# Altium schematic sheet [04] - Connectors.SchDoc
size A3; DocumentNumber: 2; SheetNumber: 2; SheetTotal: 4
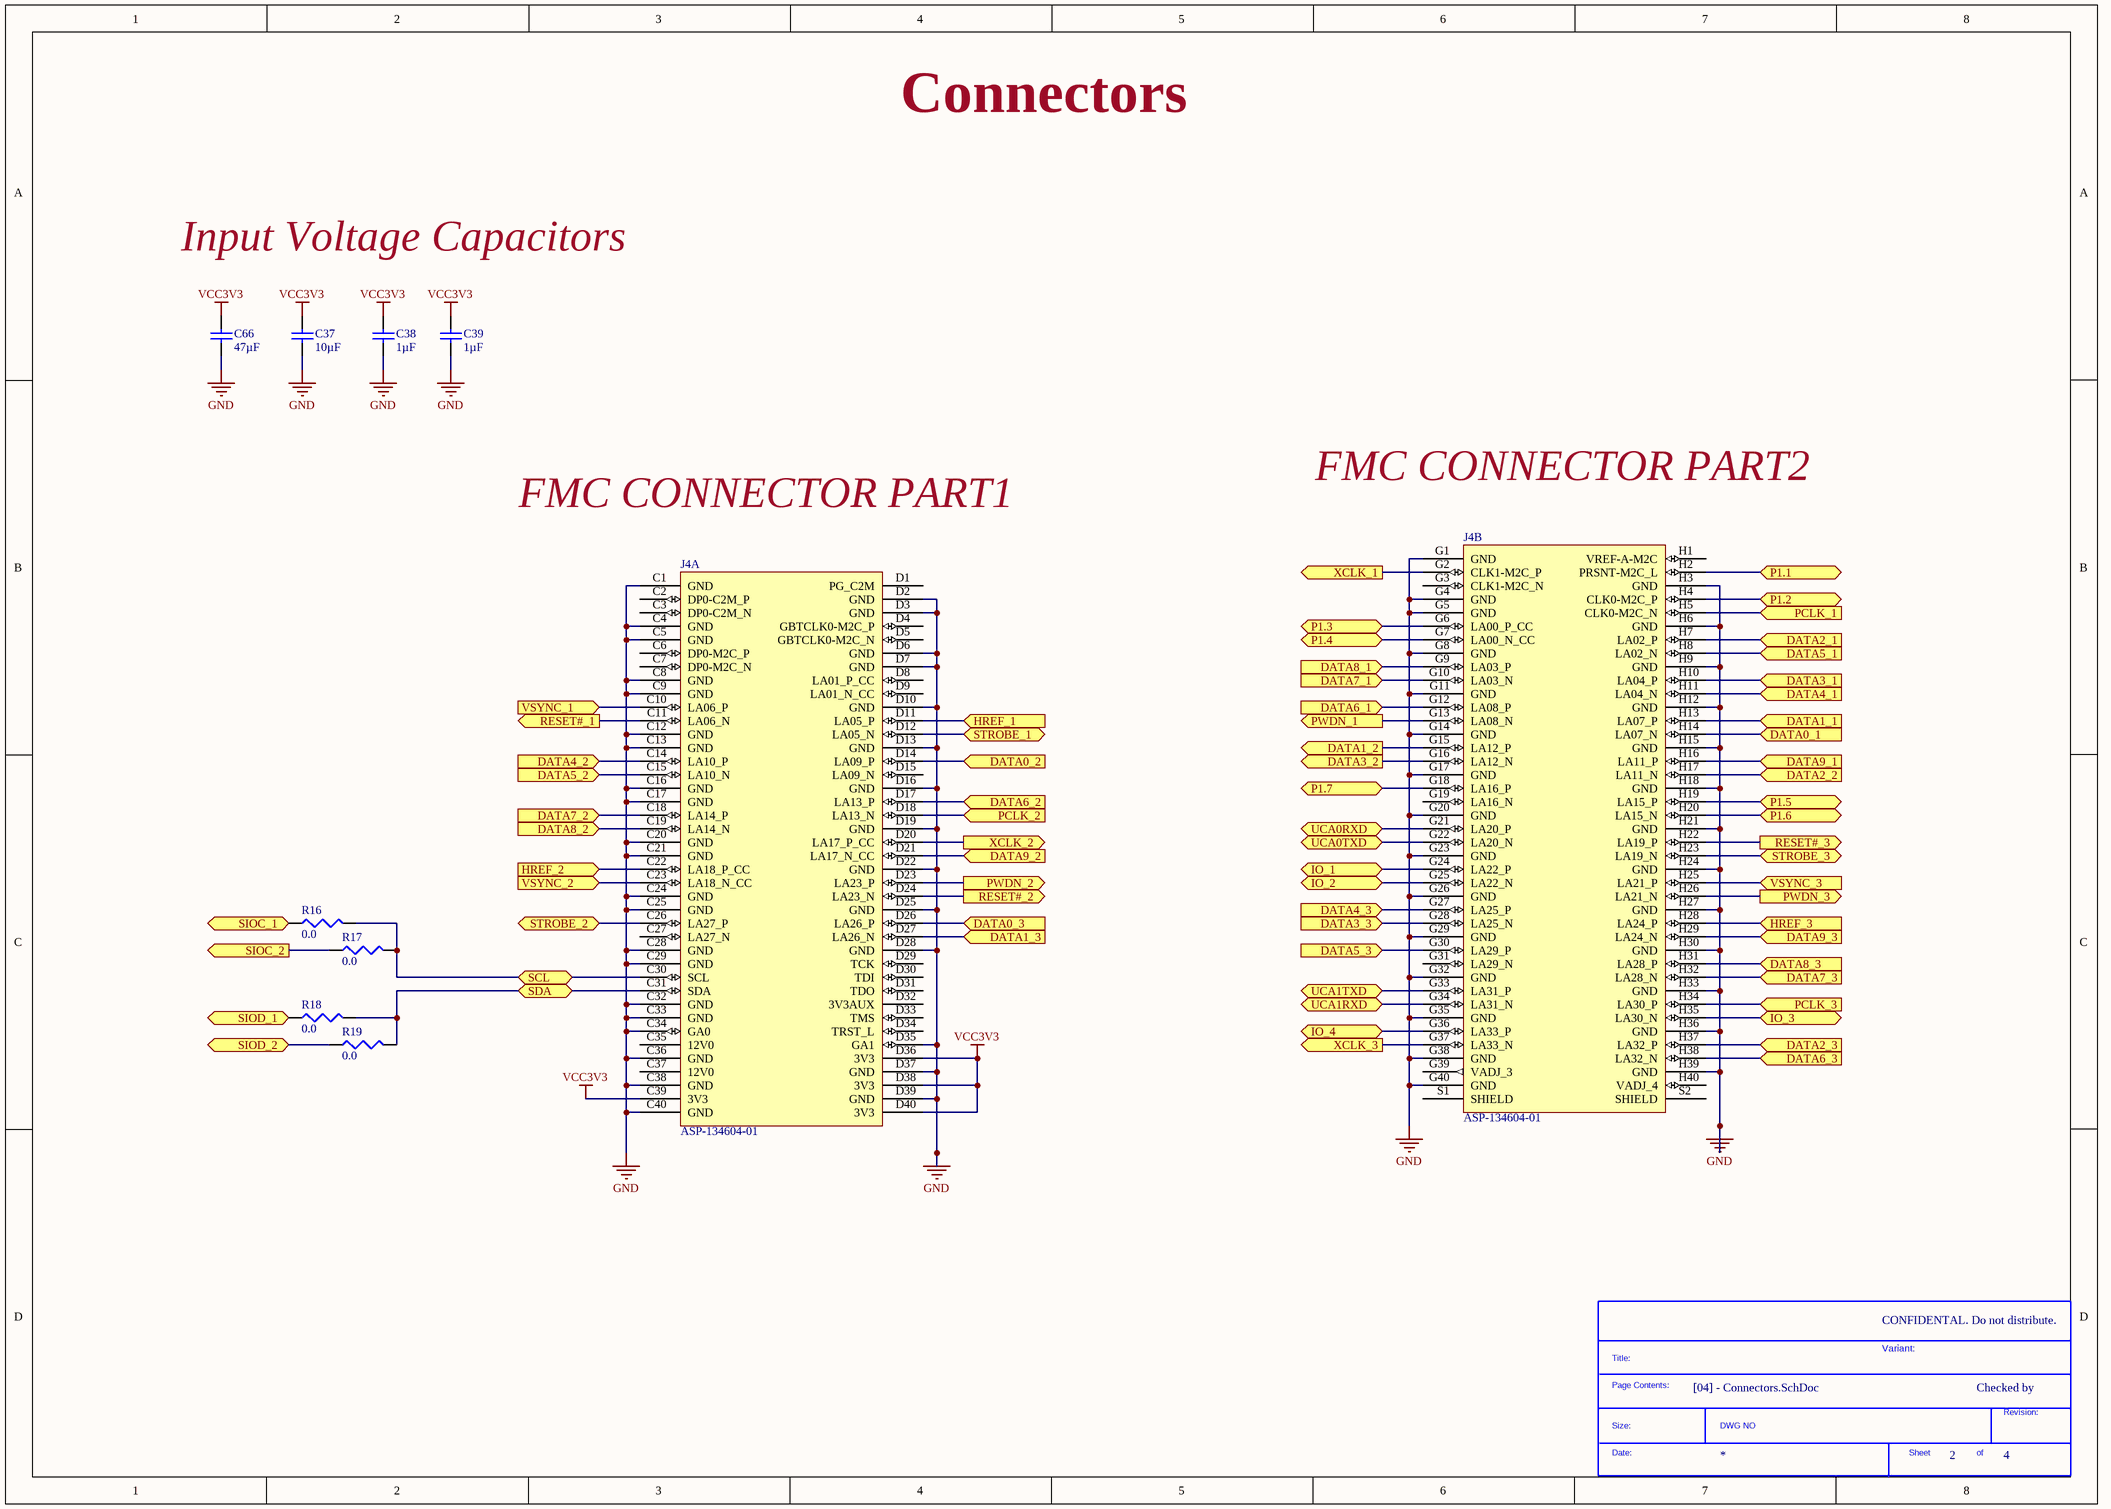
[diagram p0: [04] - Connectors.SchDoc]

## Parts
*  SDTitleBlock  (value not drawn)  (graphical)
C37  Capacitance: 10µF  [CAP-0805]  (hidden comment: GRM21BR61E106KA73L)
C38  Capacitance: 1µF  [CAP-0603]  (hidden comment: GRM188R71C105KA12D)
C39  Capacitance: 1µF  [CAP-0603]  (hidden comment: GRM188R71C105KA12D)
C66  Capacitance: 47µF  [CAP-0805]  (hidden comment: GRM21BR60J476ME15L)
J4  ASP-134604-01  [ASP-134604-01]  (parts A,B of 2)
R16  Resistance (Ohms): 0.0  [R0603]  (hidden comment: ERJ-3GEY0R00V)
R17  Resistance (Ohms): 0.0  [R0603]  (hidden comment: ERJ-3GEY0R00V)
R18  Resistance (Ohms): 0.0  [R0603]  (hidden comment: ERJ-3GEY0R00V)
R19  Resistance (Ohms): 0.0  [R0603]  (hidden comment: ERJ-3GEY0R00V)

## Ports
DATA0_1 (in), DATA0_2 (in), DATA0_3 (in), DATA1_1 (in), DATA1_2 (out), DATA1_3 (in), DATA2_1 (in), DATA2_2 (in), DATA2_3 (in), DATA3_1 (in), DATA3_2 (out), DATA3_3 (in), DATA4_1 (in), DATA4_2 (in), DATA4_3 (in), DATA5_1 (in), DATA5_2 (in), DATA5_3 (in), DATA6_1 (in), DATA6_2 (in), DATA6_3 (in), DATA7_1 (in), DATA7_2 (in), DATA7_3 (in), DATA8_1 (in), DATA8_2 (in), DATA8_3 (in), DATA9_1 (in), DATA9_2 (in), DATA9_3 (in), HREF_1 (in), HREF_2 (in), HREF_3 (in), IO_1 (bidir), IO_2 (bidir), IO_3 (bidir), IO_4 (bidir), P1.1 (bidir), P1.2 (bidir), P1.3 (bidir), P1.4 (bidir), P1.5 (bidir), P1.6 (bidir), P1.7 (bidir), PCLK_1 (in), PCLK_2 (in), PCLK_3 (in), PWDN_1 (out), PWDN_2 (out), PWDN_3 (out), RESET#_1 (out), RESET#_2 (out), RESET#_3 (out), SCL (bidir), SDA (bidir), SIOC_1 (out), SIOC_2 (out), SIOD_1 (bidir), SIOD_2 (bidir), STROBE_1 (bidir), STROBE_2 (bidir), STROBE_3 (bidir), UCA0RXD (bidir), UCA0TXD (bidir), UCA1RXD (bidir), UCA1TXD (bidir), VSYNC_1 (in), VSYNC_2 (in), VSYNC_3 (in), XCLK_1 (out), XCLK_2 (out), XCLK_3 (out)

## Nets
GND: C37.2 C38.2 C39.2 C66.2 J4.C1(GND) J4.C4(GND) J4.C5(GND) J4.C8(GND) J4.C9(GND) J4.C12(GND) J4.C13(GND) J4.C16(GND) J4.C17(GND) J4.C20(GND) J4.C21(GND) J4.C24(GND) J4.C25(GND) J4.C28(GND) J4.C29(GND) J4.C32(GND) J4.C33(GND) J4.C34(GA0) J4.C36(GND) J4.C38(GND) J4.C40(GND) J4.D2(GND) J4.D3(GND) J4.D6(GND) J4.D7(GND) J4.D10(GND) J4.D13(GND) J4.D16(GND) J4.D19(GND) J4.D22(GND) J4.D25(GND) J4.D28(GND) J4.D35(GA1) J4.D37(GND) J4.D39(GND) J4.G1(GND) J4.G4(GND) J4.G5(GND) J4.G8(GND) J4.G11(GND) J4.G14(GND) J4.G17(GND) J4.G20(GND) J4.G23(GND) J4.G26(GND) J4.G29(GND) J4.G32(GND) J4.G35(GND) J4.G38(GND) J4.G40(GND) J4.H3(GND) J4.H6(GND) J4.H9(GND) J4.H12(GND) J4.H15(GND) J4.H18(GND) J4.H21(GND) J4.H24(GND) J4.H27(GND) J4.H30(GND) J4.H33(GND) J4.H36(GND) J4.H39(GND)
VCC3V3: C37.1 C38.1 C39.1 C66.1 J4.C39(3V3) J4.D36(3V3) J4.D38(3V3) J4.D40(3V3)
DATA0_1: J4.H14(LA07_N) ; port DATA0_1
DATA0_2: J4.D14(LA09_P) ; port DATA0_2
DATA0_3: J4.D26(LA26_P) ; port DATA0_3
DATA1_1: J4.H13(LA07_P) ; port DATA1_1
DATA1_2: J4.G15(LA12_P) ; port DATA1_2
DATA1_3: J4.D27(LA26_N) ; port DATA1_3
DATA2_1: J4.H7(LA02_P) ; port DATA2_1
DATA2_2: J4.H17(LA11_N) ; port DATA2_2
DATA2_3: J4.H37(LA32_P) ; port DATA2_3
DATA3_1: J4.H10(LA04_P) ; port DATA3_1
DATA3_2: J4.G16(LA12_N) ; port DATA3_2
DATA3_3: J4.G28(LA25_N) ; port DATA3_3
DATA4_1: J4.H11(LA04_N) ; port DATA4_1
DATA4_2: J4.C14(LA10_P) ; port DATA4_2
DATA4_3: J4.G27(LA25_P) ; port DATA4_3
DATA5_1: J4.H8(LA02_N) ; port DATA5_1
DATA5_2: J4.C15(LA10_N) ; port DATA5_2
DATA5_3: J4.G30(LA29_P) ; port DATA5_3
DATA6_1: J4.G12(LA08_P) ; port DATA6_1
DATA6_2: J4.D17(LA13_P) ; port DATA6_2
DATA6_3: J4.H38(LA32_N) ; port DATA6_3
DATA7_1: J4.G10(LA03_N) ; port DATA7_1
DATA7_2: J4.C18(LA14_P) ; port DATA7_2
DATA7_3: J4.H32(LA28_N) ; port DATA7_3
DATA8_1: J4.G9(LA03_P) ; port DATA8_1
DATA8_2: J4.C19(LA14_N) ; port DATA8_2
DATA8_3: J4.H31(LA28_P) ; port DATA8_3
DATA9_1: J4.H16(LA11_P) ; port DATA9_1
DATA9_2: J4.D21(LA17_N_CC) ; port DATA9_2
DATA9_3: J4.H29(LA24_N) ; port DATA9_3
HREF_1: J4.D11(LA05_P) ; port HREF_1
HREF_2: J4.C22(LA18_P_CC) ; port HREF_2
HREF_3: J4.H28(LA24_P) ; port HREF_3
IO_1: J4.G24(LA22_P) ; port IO_1
IO_2: J4.G25(LA22_N) ; port IO_2
IO_3: J4.H35(LA30_N) ; port IO_3
IO_4: J4.G36(LA33_P) ; port IO_4
P1.1: J4.H2(PRSNT-M2C_L) ; port P1.1
P1.2: J4.H4(CLK0-M2C_P) ; port P1.2
P1.3: J4.G6(LA00_P_CC) ; port P1.3
P1.4: J4.G7(LA00_N_CC) ; port P1.4
P1.5: J4.H19(LA15_P) ; port P1.5
P1.6: J4.H20(LA15_N) ; port P1.6
P1.7: J4.G18(LA16_P) ; port P1.7
PCLK_1: J4.H5(CLK0-M2C_N) ; port PCLK_1
PCLK_2: J4.D18(LA13_N) ; port PCLK_2
PCLK_3: J4.H34(LA30_P) ; port PCLK_3
PWDN_1: J4.G13(LA08_N) ; port PWDN_1
PWDN_2: J4.D23(LA23_P) ; port PWDN_2
PWDN_3: J4.H26(LA21_N) ; port PWDN_3
RESET#_1: J4.C11(LA06_N) ; port RESET#_1
RESET#_2: J4.D24(LA23_N) ; port RESET#_2
RESET#_3: J4.H22(LA19_P) ; port RESET#_3
SCL: J4.C30(SCL) R16.2 R17.2 ; port SCL
SDA: J4.C31(SDA) R18.2 R19.2 ; port SDA
SIOC_1: R16.1 ; port SIOC_1
SIOC_2: R17.1 ; port SIOC_2
SIOD_1: R18.1 ; port SIOD_1
SIOD_2: R19.1 ; port SIOD_2
STROBE_1: J4.D12(LA05_N) ; port STROBE_1
STROBE_2: J4.C26(LA27_P) ; port STROBE_2
STROBE_3: J4.H23(LA19_N) ; port STROBE_3
UCA0RXD: J4.G21(LA20_P) ; port UCA0RXD
UCA0TXD: J4.G22(LA20_N) ; port UCA0TXD
UCA1RXD: J4.G34(LA31_N) ; port UCA1RXD
UCA1TXD: J4.G33(LA31_P) ; port UCA1TXD
VSYNC_1: J4.C10(LA06_P) ; port VSYNC_1
VSYNC_2: J4.C23(LA18_N_CC) ; port VSYNC_2
VSYNC_3: J4.H25(LA21_P) ; port VSYNC_3
XCLK_1: J4.G2(CLK1-M2C_P) ; port XCLK_1
XCLK_2: J4.D20(LA17_P_CC) ; port XCLK_2
XCLK_3: J4.G37(LA33_N) ; port XCLK_3

Not connected (* = marked no-connect by the designer): J4 C2(DP0-C2M_P) C3(DP0-C2M_N) C6(DP0-M2C_P) C7(DP0-M2C_N) C27(LA27_N) C35(12V0) C37(12V0) D1(PG_C2M) D4(GBTCLK0-M2C_P) D5(GBTCLK0-M2C_N) D8(LA01_P_CC) D9(LA01_N_CC) D15(LA09_N) D29(TCK) D30(TDI) D31(TDO) D32(3V3AUX) D33(TMS) D34(TRST_L) G3(CLK1-M2C_N) G19(LA16_N) G31(LA29_N) G39(VADJ_3) H1(VREF-A-M2C) H40(VADJ_4) S1(SHIELD) S2(SHIELD)

## Notes on the sheet
- Connectors
- Input Voltage Capacitors
- FMC CONNECTOR PART1
- FMC CONNECTOR PART2
- CONFIDENTAL. Do not distribute.
- Variant:
- Checked by
- (in symbol SDTitleBlock) Title:; Page Contents:; Revision:; Size:; DWG NO; Date:; Sheet; of

## Library data of the parts
C37 = GRM21BR61E106KA73L: CAP CER 10UF 25V X5R 0805; Manufacturer: Murata Electronics North America; Tolerance: ±10%; Supplier 1: Digi-Key; Manufacturer Part Number: GRM21BR61E106KA73L; RoHS: RoHS Compliant; Category: Capacitors; Stock 1: 242003; Pricing 1: 1=0.2, 10=0.136, 50=0.0826, 100=0.0693 (USD); Packaging: Cut Tape (CT); Voltage - Rated: 25V; Temperature Coefficient: X5R; Mounting Type: Surface Mount, MLCC; Operating Temperature: -55°C ~ 85°C; Applications: General Purpose; Ratings: -; Package / Case: 0805 (2012 Metric); Size / Dimension: 0.079" L x 0.049" W (2.00mm x 1.25mm); Height - Seated (Max): -; Thickness (Max): 0.053" (1.35mm); Lead Spacing: -; Features: -; Lead Style: -; ComponentLink1URL: http://www.murata.com/~/media/webrenewal/support/library/catalog/products/capacitor/mlcc/c02e.pdf; ComponentLink1Description: http://www.murata.com/~/media/webrenewal/support/library/catalog/products/capacitor/mlcc/c02e.pdf; Supplier Part Number 1: 490-5523-1-ND
C38 C39 = GRM188R71C105KA12D: CAP CER 1UF 16V X7R 0603; Manufacturer: Murata Electronics North America; Tolerance: ±10%; Supplier 1: Digi-Key; Manufacturer Part Number: GRM188R71C105KA12D; RoHS: RoHS Compliant; Category: Capacitors; Stock 1: 819049; Pricing 1: 1=0.1, 10=0.073, 50=0.0396, 100=0.0336, 250=0.02744, 500=0.02348, 1000=0.0183 (USD); Packaging: Cut Tape (CT); Voltage - Rated: 16V; Temperature Coefficient: X7R; Mounting Type: Surface Mount, MLCC; Operating Temperature: -55°C ~ 125°C; Applications: General Purpose; Ratings: -; Package / Case: 0603 (1608 Metric); Size / Dimension: 0.063" L x 0.031" W (1.60mm x 0.80mm); Height - Seated (Max): -; Thickness (Max): 0.035" (0.90mm); Lead Spacing: -; Features: -; Lead Style: -; ComponentLink1URL: http://www.murata.com/~/media/webrenewal/support/library/catalog/products/capacitor/mlcc/c02e.pdf; ComponentLink1Description: http://www.murata.com/~/media/webrenewal/support/library/catalog/products/capacitor/mlcc/c02e.pdf; Supplier Part Number 1: 490-3900-1-ND
C66 = GRM21BR60J476ME15L: CAP CER 47UF 6.3V X5R 0805; Manufacturer: Murata Electronics North America; Tolerance: ±20%; Supplier 1: Digi-Key; Manufacturer Part Number: GRM21BR60J476ME15L; RoHS: RoHS Compliant; Category: Capacitors; Stock 1: 2019; Pricing 1: 1=0.5, 10=0.48, 50=0.2864, 100=0.2327, 250=0.19332, 500=0.17542, 1000=0.1611 (USD); Packaging: Cut Tape (CT); Voltage - Rated: 6.3V; Temperature Coefficient: X5R; Mounting Type: Surface Mount, MLCC; Operating Temperature: -55°C ~ 85°C; Applications: General Purpose; Ratings: -; Package / Case: 0805 (2012 Metric); Size / Dimension: 0.079" L x 0.049" W (2.00mm x 1.25mm); Height - Seated (Max): -; Thickness (Max): 0.057" (1.45mm); Lead Spacing: -; Features: Derating Recommended; Lead Style: -; ComponentLink1URL: http://www.murata.com/~/media/webrenewal/support/library/catalog/products/capacitor/mlcc/c02e.pdf; ComponentLink1Description: http://www.murata.com/~/media/webrenewal/support/library/catalog/products/capacitor/mlcc/c02e.pdf; Supplier Part Number 1: 490-9960-1-ND
J4 = ASP-134604-01: SAMTEC - ASP-134604-01 - Board-To-Board Connector, Vita 57 XMC, ASP Series, Surface Mount, Header, 160, 1.27 mm; Supplier 1: Newark; Manufacturer: SAMTEC; Manufacturer Part Number: ASP-134604-01; RoHS: YES; Stock 1: 636; Pricing 1: 1=16.5, 10=15.6, 50=14.28, 100=12.96, 250=12.3, 500=11.72, 1000=11.55 (USD); ComponentLink1URL: http://www.farnell.com/cad/1838626.pdf; ComponentLink1Description: http://www.farnell.com/cad/1838626.pdf; Supplier Part Number 1: 79X1317
R16-R19 = ERJ-3GEY0R00V: RES SMD 0.0OHM JUMPER 1/10W 0603; Manufacturer: Panasonic Electronic Components; Power (Watts): 0.1W, 1/10W; Supplier 1: Digi-Key; Manufacturer Part Number: ERJ-3GEY0R00V; RoHS: RoHS Compliant; Category: Resistors; Stock 1: 7608993; Pricing 1: 1=0.1, 50=0.0126, 100=0.0096, 250=0.00716, 500=0.00528, 1000=0.00352, 2500=0.00297 (USD); Packaging: Cut Tape (CT); Tolerance: Jumper; Composition: Thick Film; Features: Automotive AEC-Q200; Temperature Coefficient: -; Operating Temperature: -55°C ~ 155°C; Package / Case: 0603 (1608 Metric); Supplier Device Package: 0603; Size / Dimension: 0.063" L x 0.031" W (1.60mm x 0.80mm); Height: 0.022" (0.55mm); Number of Terminations: 2; ComponentLink1URL: http://industrial.panasonic.com/www-cgi/jvcr13pz.cgi?E+PZ+3+AOA0001+ERJ3GEY0R00V+7+WW; ComponentLink1Description: http://industrial.panasonic.com/www-cgi/jvcr13pz.cgi?E+PZ+3+AOA0001+ERJ3GEY0R00V+7+WW; Supplier Part Number 1: P0.0GCT-ND